# EAGLE design deskaLED (EAGLE 9.1.3)
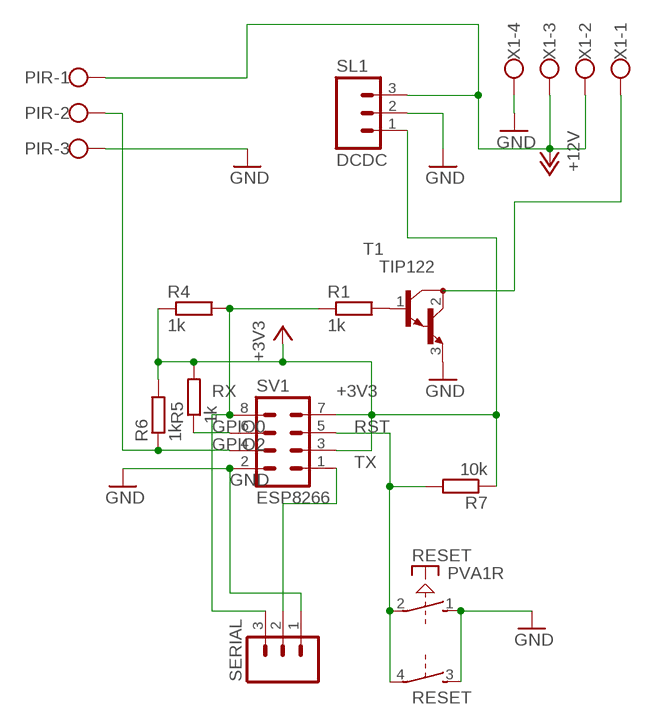
[diagram p0: schematic, sheet 1]

## Parts
PIR  W237-103  [W237-103]
R1  1k  R-EU_0207/10  [0207/10]
R4  1k  R-EU_0207/10  [0207/10]
R5  1k  R-EU_0207/10  [0207/10]
R6  1k  R-EU_0207/10  [0207/10]
R7  10k  R-EU_0207/10  [0207/10]
RESET  PVA1R  [PVA1R]
SERIAL  M03  [03P]
SL1  DCDC  M03  [03P]
SV1  ESP8266  MA04-2  [MA04-2]
T1  TIP122  [TO220]
X1  W237-4  [W237-4]

## Nets
+3V3: R4.1 R5.2 R6.2 R7.1 SL1.1 SV1.3 SV1.7
+12V: PIR.1 SL1.3 X1.2 X1.3
GND: PIR.3 RESET.1(1:S) RESET.3(2:S) SERIAL.1 SL1.2 SV1.2 T1.3(E) X1.4
GPIO0: R5.1 SV1.6
GPIO2: PIR.2 R6.1 SV1.4
N$1: T1.2(C) X1.1
N$4: R1.2 T1.1(B)
RST: R7.2 RESET.2(1:P) RESET.4(2:P) SV1.5
RX: R1.1 R4.2 SERIAL.3 SV1.8
TX: SERIAL.2 SV1.1

## Library data of the parts
PIR = con-wago-500:W237-103: WAGO SCREW CLAMP; MPN: 237-103; OC_FARNELL: unknown; OC_NEWARK: 18M7116
R1 R4-R7 = rcl:R-EU_: RESISTOR, European symbol
RESET = switch-misc:PVA1R: ITT SWITCH
SERIAL SL1 = con-amp-quick:M03: AMP QUICK CONNECTOR; OC_FARNELL: unknown; OC_NEWARK: unknown
SV1 = con-lstb:MA04-2: PIN HEADER; OC_FARNELL: unknown; OC_NEWARK: unknown
T1 = transistor:TIP122: NPN BIPOLAR DARLINGTON TRANSISTOR
X1 = con-wago-500:W237-4: WAGO SCREW CLAMP; OC_FARNELL: unknown; OC_NEWARK: unknown

## Board
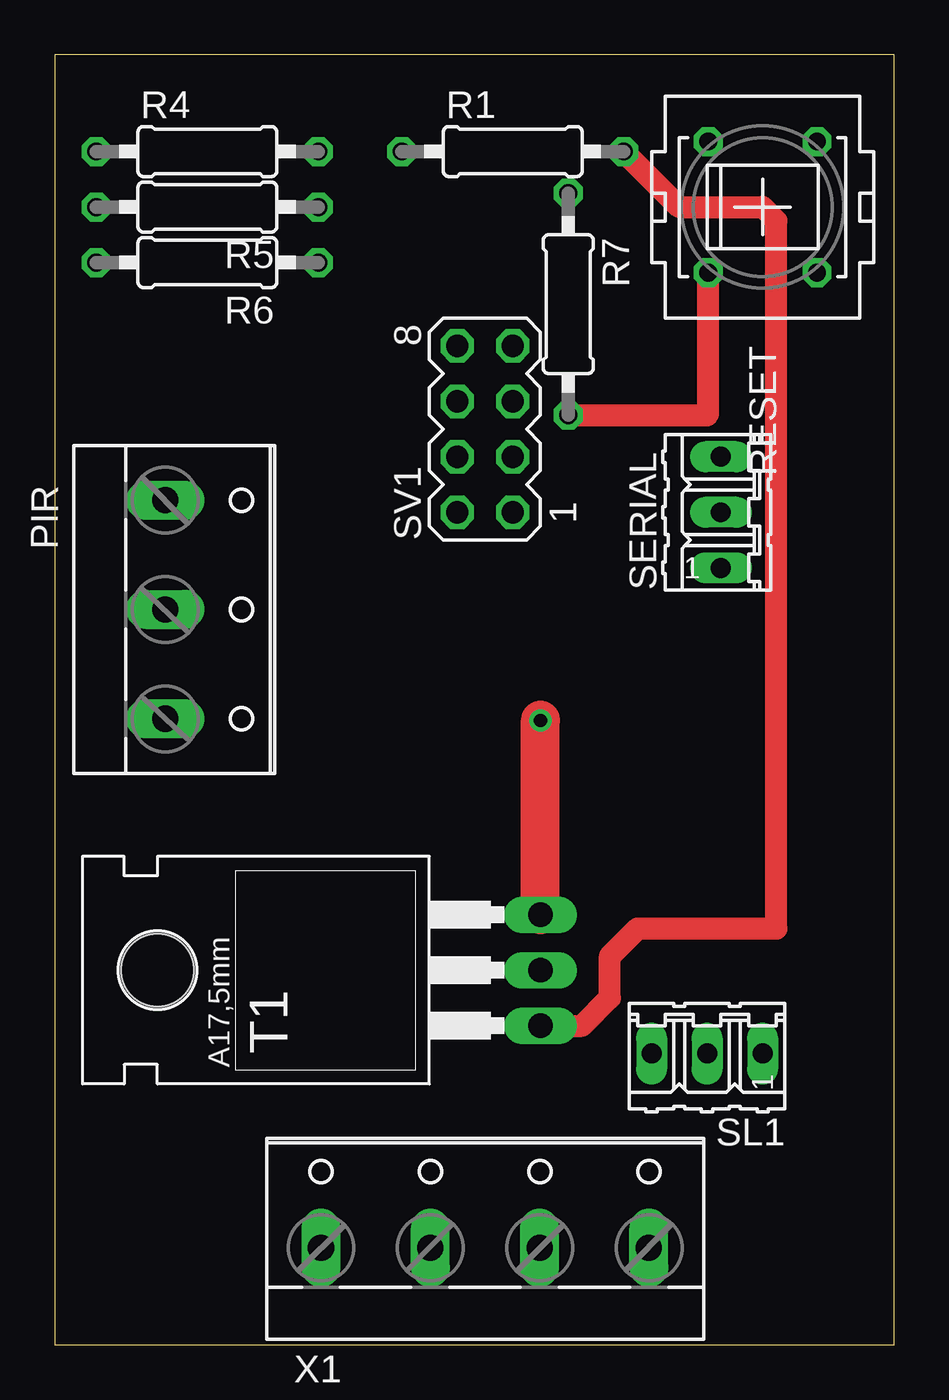
[diagram p1: board, top side]
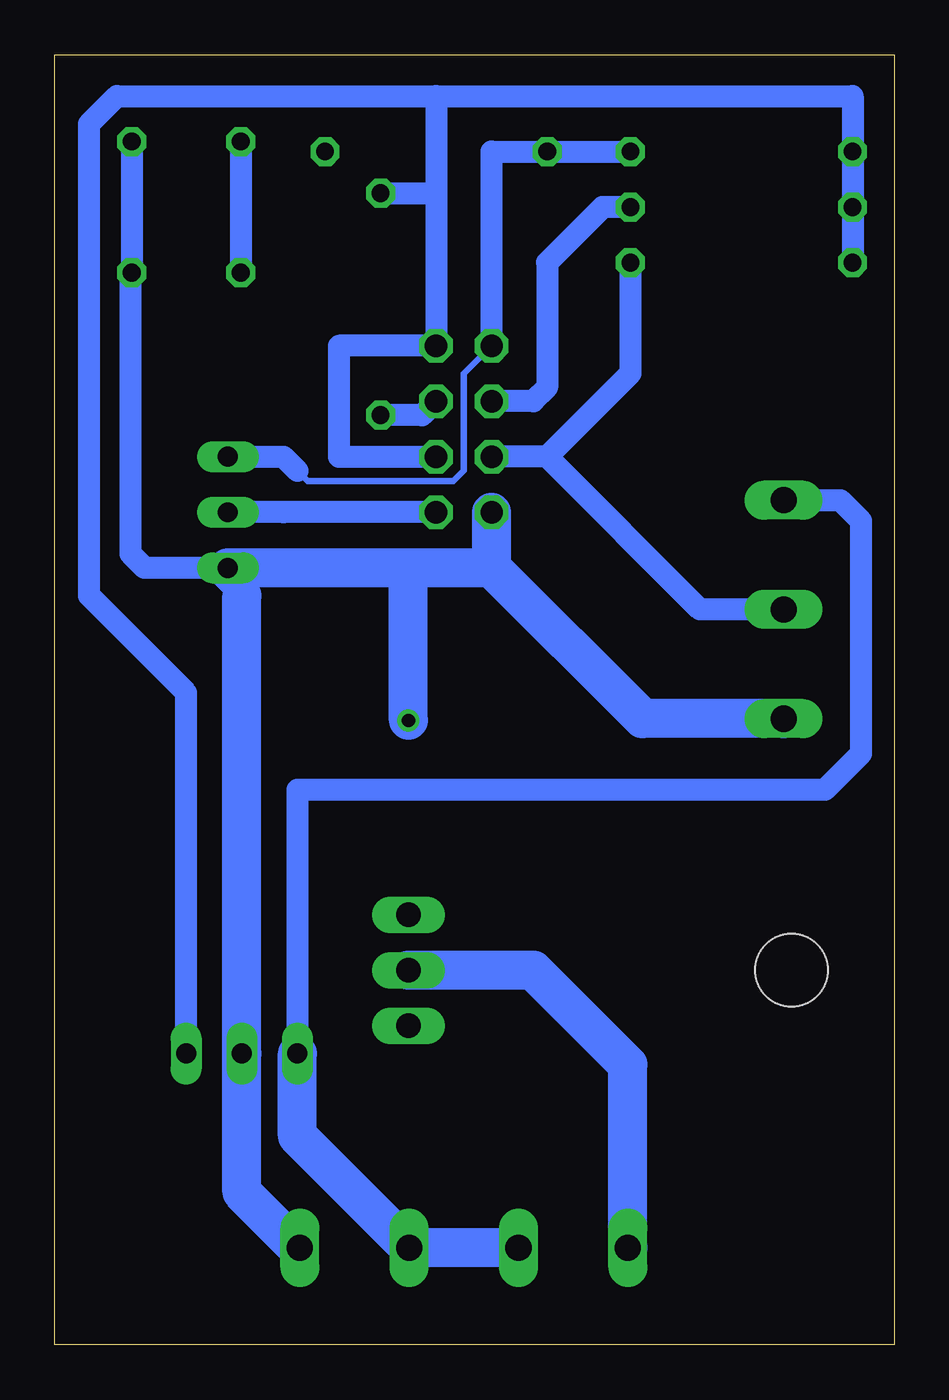
[diagram p2: board, bottom side, seen from below]

Size 38.41 x 59.04 mm. Coordinates in mm from the lower left corner, seen from the top.
Outline: 0,0 38.41,0 38.41,59.04 0,59.04 0,0
Copper layers (1*16): Top 0.035mm / dielectric 1.5mm / Bottom 0.035mm
Design rules "default": minimum track width 10mil, minimum drill 24mil, track to track 8mil, track to pad 8mil, pad to pad 8mil, via to via 8mil, smd to smd 8mil, copper to edge 40mil, drill to drill 8mil, minimum pad ring 10mil, minimum via ring 8mil, stop-mask expansion 4mil, vias tented up to drill 0mil, thermal gap 10mil

### Footprints (pad centres in the part's own frame; a part is rotated, then mirrored left to right if it is on the bottom)
W237-103 = drill 1.194 long: 1 -5,-1.29; 2 0,-1.29; 3 5,-1.29
0207/10 = drill 0.813 octagon: 1 -5.08,0; 2 5.08,0
PVA1R = drill 0.813 octagon: 1 -2.997,2.489; 2 -2.997,-2.489; 3 2.997,2.489; 4 2.997,-2.489
03P = drill 0.914 long: 1 -2.54,0; 2 0,0; 3 2.54,0
MA04-2 = drill 1.016 octagon: 1 -3.81,-1.27; 2 -3.81,1.27; 3 -1.27,-1.27; 4 -1.27,1.27; 5 1.27,-1.27; 6 1.27,1.27; 7 3.81,-1.27; 8 3.81,1.27
TO220 = drill 1.118 long: 1 -2.54,-6.35; 2 0,-6.35; 3 2.54,-6.35 | hole 3.302: 0,11.176
W237-4 = drill 1.194 long: 1 -7.5,-1.27; 2 -2.5,-1.27; 3 2.5,-1.27; 4 7.5,-1.27

### Placement (x,y rotation side)
PIR  6.35,33.66 270 top
R1  20.95,54.61 0 top
R4  6.98,54.61 0 top
R5  6.98,52.07 180 top
R6  6.98,49.53 180 top
R7  23.5,47.62 270 top
RESET  32.38,52.07 270 top
SERIAL  30.48,38.1 90 top
SL1  29.84,13.34 180 top
SV1  19.68,41.91 90 top
T1  15.88,17.14 90 top
X1  19.68,5.71 0 top

### Tracks (layer width: path | path; a pad name or v marks a point on that pad's centre or on a via)
+3V3
  Bottom 1.016: SV1.3 25.4,40.64 25.4,45.72 SV1.7 20.95,52.71 | R6.2 R5.2 R4.1 1.9,57.15 20.95,57.15 | 20.95,57.15 20.95,52.71 | R7.1 20.95,52.71 | SL1.1 32.38,29.84 36.83,34.29 36.83,55.88 35.56,57.15 20.95,57.15
+12V
  Bottom 1.016: PIR.1 2.46,38.66 1.52,37.72 1.52,27.05 3.17,25.4 27.3,25.4 SL1.3
  Bottom 1.778: X1.2 X1.3 27.3,9.57 SL1.3
GND  (via drill 0.61)
  Top 1.778: T1.3 v22.23,28.58
  Bottom 1.016: RESET.1 RESET.3 34.92,49.02 34.92,36.2 34.29,35.56 31.12,35.56 | SERIAL.1 31.12,35.56 | X1.4 27.3,4.45 | 29.84,34.29 31.12,35.56
  Bottom 1.778: 18.41,35.56 22.23,35.56 | 22.23,35.56 SERIAL.1 | 18.41,35.56 SV1.2 | PIR.3 11.51,28.66 18.41,35.56 | 27.3,4.45 29.84,6.98 SL1.2 29.84,34.29 | v22.23,28.58 22.23,35.56
GPIO0
  Bottom 1.016: R5.1 13.34,52.07 15.88,49.53 15.88,43.81 16.51,43.18 SV1.6
GPIO2
  Bottom 1.016: 15.88,40.64 SV1.4 | PIR.2 8.89,33.66 15.88,40.64 | R6.1 12.07,44.45 15.88,40.64
N$1
  Bottom 1.778: X1.1 12.18,12.82 16.51,17.14 T1.2
N$4
  Top 1.016: R1.2 28.58,52.07 32.38,52.07 33.02,51.44 33.02,19.05 26.67,19.05 25.4,17.78 25.4,15.88 24.13,14.61 T1.1
RST
  Top 1.016: R7.2 29.84,42.55 29.9,42.6 RESET.4
  Bottom 1.016: R7.2 21.59,42.55 SV1.5 | RESET.2 RESET.4
RX
  Bottom 0.305: 27.3,40.01 26.82,39.52 20.17,39.52 19.68,40.01 19.68,44.45 SV1.8
  Bottom 1.016: SV1.8 18.41,54.61 R1.1 R4.2 | SERIAL.3 27.94,40.64 27.3,40.01
TX
  Bottom 1.016: SV1.1 27.94,38.1 SERIAL.2